# Altium schematic sheet Alim.SchDoc
size A4
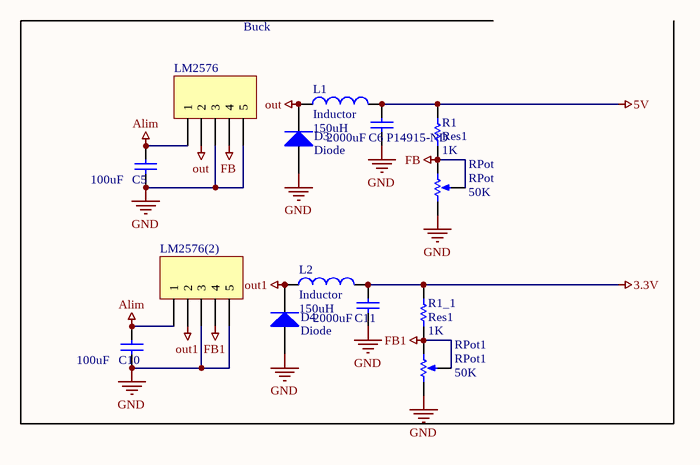
[diagram p0: Alim.SchDoc]

## Parts
C5  value 100uF  [Condo alim 1]  (hidden comment: Cap Semi)
C6_P14915-ND  value 2000uF  [Capacité alim 2]  (hidden comment: Cap Semi)
C10  value 100uF  [Condo alim 1]  (hidden comment: Cap Semi)
C11  value 2000uF  [Capacité alim 2]  (hidden comment: Cap Semi)
D3  Diode  [Diode alim]
D4  Diode  [Diode alim]
L1  Inductor  value 150uH  [Inductance alim]
L2  Inductor  value 150uH  [Inductance alim]
LM2576  Header 5H  [LM276]  (value not drawn)
LM2576(2)  Header 5H  [LM276]  (value not drawn)
R1  Res1  value 1K  [470  and 4.7k Resistance]
R1_1  Res1  value 1K  [470  and 4.7k Resistance]
RPot  RPot  value 50K  [Potentionmètre 50k]
RPot1  RPot1  value 50K  [Potentionmètre 50k]

## Nets
3.3V: C11.2 L2.2 R1_1.1
5V: C6_P14915-ND.2 L1.2 R1.1
Alim: C5.2 C10.2 LM2576.1 LM2576(2).1
FB: LM2576.4 R1.2 RPot.2(BOT) RPot.3(TAP)
FB1: LM2576(2).4 R1_1.2 RPot1.2(TAP) RPot1.3(BOT)
GND: C5.1 C6_P14915-ND.1 C10.1 C11.1 D3.1(A) D4.1(A) LM2576.3 LM2576.5 LM2576(2).3 LM2576(2).5 RPot.1(TOP) RPot1.1(TOP)
out: D3.2(K) L1.1 LM2576.2
out1: D4.2(K) L2.1 LM2576(2).2

## Notes on the sheet
- Buck

## Library data of the parts
C5 C6_P14915-ND C10 C11 = Cap Semi: Capacitor (Semiconductor SIM Model); Published: 8-Jun-2000; LatestRevisionDate: 29-May-2009; LatestRevisionNote: IPC-7351 Footprint Added.; PackageReference: C1206; Publisher: Altium Limited; PackageDescription: Chip Capacitor
D3 D4 = Diode: Default Diode; Published: 8-Jun-2000; LatestRevisionDate: 17-Jul-2002; LatestRevisionNote: Re-released for DXP Platform.; PackageVersion: Sep-1996; PackageReference: SMC; Publisher: Altium Limited; PackageDescription: DO-214-AB/SMC; 2 C-Bend Leads; Body 7.9 x 5.9 mm, inc. leads (LxW); Code_JEDEC: DO-214-AB
L1 L2 = Inductor: Code_IEC: 1005; Published: 8-Jun-2000; LatestRevisionDate: 29-May-2009; LatestRevisionNote: IPC-7351 Footprint Added.; PackageReference: 0402-A; Publisher: Altium Limited; PackageDescription: Chip Inductor; Code_JEITA: 0402
LM2576 LM2576(2) = Header 5H: Header, 5-Pin, Right Angle; LatestRevisionDate: 17-Jul-2002; LatestRevisionNote: Re-released for DXP Platform.; Publisher: Altium Limited
R1 R1_1 = Res1: Resistor; Published: 8-Jun-2000; LatestRevisionDate: 17-Jul-2002; LatestRevisionNote: Re-released for DXP Platform.; PackageReference: AXIAL-0.3; Publisher: Altium Limited; PackageDescription: Axial Device, Thru-Hole; 2 Leads; 0.3 in Pin Spacing
RPot RPot1 = RPot: Potentiometer; Sim Note: Enter the Resistance value and the set point into parameter fields.; Set Position: 0.5; Published: 8-Jun-2000; LatestRevisionDate: 17-Jul-2002; LatestRevisionNote: Re-released for DXP Platform.; PackageReference: VR5; Publisher: Altium Limited; PackageDescription: Variable Resistor, Thru-Hole; 3 Leads